# Altium schematic sheet MCU2.SchDoc: Hat MCU Group 24
size A3; DrawnBy: Jonny, Jamie, John, David; Address1: ECE Department; Address2: University of Canterbury; Address3: Christchurch 8041; Address4: New Zealand; Revision: 2; SheetNumber: 2; SheetTotal: 2; ImagePath: \\maxwell\elecapp\AltiumDesigner\Templates\uc-logo.png
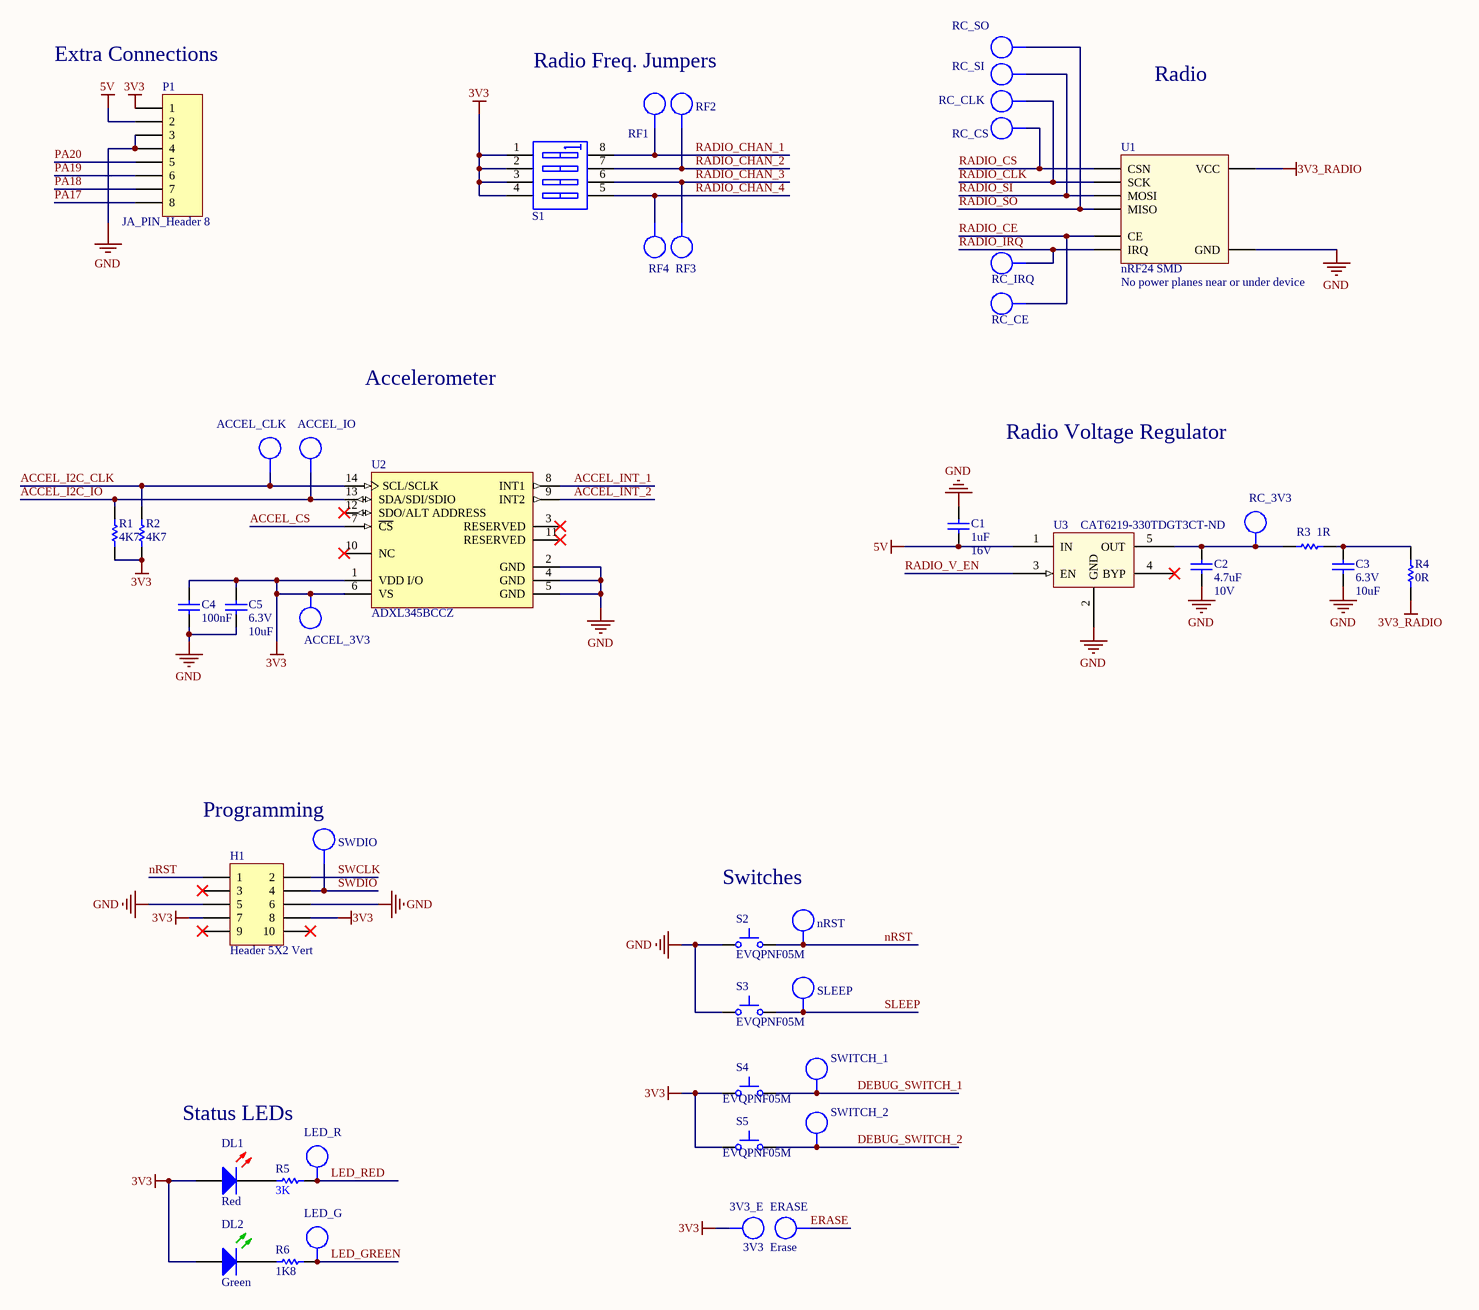
[diagram p0: MCU2.SchDoc]

## Parts
3V3_E  3V3  [TP_1206]  (no BOM)
ACCEL_3V3  TP  [TP_1206]  (value not drawn)  (no BOM)
ACCEL_CLK  TP  [TP_1206]  (value not drawn)  (no BOM)
ACCEL_IO  TP  [TP_1206]  (value not drawn)  (no BOM)
C1  Max Voltage: 16V  [CAPC1608L]  (hidden comment: 1uF)
C2  Max Voltage: 10V  [CAPC1608N]  (hidden comment: 4.7uF)
C3  Voltage - Rated: 6.3V  [CAPC1608L]  (hidden comment: 10uF)
C4  100nF  [CAPC1608L]
C5  Voltage - Rated: 6.3V  [CAPC1608L]  (hidden comment: 10uF)
DL1  Red  [WL-SMCW0603]
DL2  Green  [WL-SMCW0603]
ERASE  Erase  [TP_1206]  (no BOM)
H1  Header 5X2 Vert  [IDC2.54-V10D]
LED_G  TP  [TP_1206]  (value not drawn)  (no BOM)
LED_R  TP  [TP_1206]  (value not drawn)  (no BOM)
nRST  TP  [TP_1206]  (value not drawn)  (no BOM)
P1  JA_PIN_Header 8  [HDR1X8]
R1  4K7  [RESC1608L]
R2  4K7  [RESC1608L]
R3  1R  [RESC3216L]
R4  0R  [RESC1608L]
R5  3K  [RESC1608L]
R6  1K8  [RESC1608L]
RC_3V3  TP  [TP_1206]  (value not drawn)  (no BOM)
RC_CE  TP  [TP_1206]  (value not drawn)  (no BOM)
RC_CLK  TP  [TP_1206]  (value not drawn)  (no BOM)
RC_CS  TP  [TP_1206]  (value not drawn)  (no BOM)
RC_IRQ  TP  [TP_1206]  (value not drawn)  (no BOM)
RC_SI  TP  [TP_1206]  (value not drawn)  (no BOM)
RC_SO  TP  [TP_1206]  (value not drawn)  (no BOM)
RF1  TP  [TP_1206]  (value not drawn)  (no BOM)
RF2  TP  [TP_1206]  (value not drawn)  (no BOM)
RF3  TP  [TP_1206]  (value not drawn)  (no BOM)
RF4  TP  [TP_1206]  (value not drawn)  (no BOM)
S1  WS_SW DIP-4  [DIP_SW_4WAY_SMD -]  (value not drawn)
S2  EVQPNF05M  [EVQPNF05M]
S3  EVQPNF05M  [EVQPNF05M]
S4  EVQPNF05M  [EVQPNF05M]
S5  EVQPNF05M  [EVQPNF05M]
SLEEP  TP  [TP_1206]  (value not drawn)  (no BOM)
SWDIO  TP  [TP_1206]  (value not drawn)  (no BOM)
SWITCH_1  TP  [TP_1206]  (value not drawn)  (no BOM)
SWITCH_2  TP  [TP_1206]  (value not drawn)  (no BOM)
U1  nRF24 SMD  Warning: No power planes near or under device  [NRF24]
U2  ADXL345BCCZ  [ADI-CC-14-1_V]
U3  Supplier Part Number: CAT6219-330TDGT3CT-ND  [SOT95P280X145-5N]  (hidden comment: CAT6219-330TDGT3)

## Nets
3V3: 3V3_E.1 ACCEL_3V3.1 C4.2 C5.2 DL1.2(A) DL2.2(A) H1.7 H1.8 P1.1 R1.1 R2.1 S1.1(A1) S1.2(A2) S1.3(A3) S1.4(A4) S4.1 S5.1 U2.1(VDD_I/O) U2.6(VS)
3V3_RADIO: R4.1 U1.1(VCC)
5V: C1.1 P1.2 U3.1(IN)
GND: C1.2 C2.1 C3.1 C4.1 C5.1 H1.5 H1.6 P1.3 P1.4 S2.1 S3.1 U1.2(GND) U2.2(GND) U2.4(GND) U2.5(GND) U3.2(GND)
ACCEL_CS: U2.7(~{CS})
ACCEL_I2C_CLK: ACCEL_CLK.1 R2.2 U2.14(SCL/SCLK)
ACCEL_I2C_IO: ACCEL_IO.1 R1.2 U2.13(SDA/SDI/SDIO)
ACCEL_INT_1: U2.8(INT1)
ACCEL_INT_2: U2.9(INT2)
DEBUG_SWITCH_1: S4.2 SWITCH_1.1
DEBUG_SWITCH_2: S5.2 SWITCH_2.1
ERASE: ERASE.1
LED_GREEN: LED_G.1 R6.2
LED_RED: LED_R.1 R5.2
nRST: H1.1 nRST.1 S2.2
PA17: P1.8
PA18: P1.7
PA19: P1.6
PA20: P1.5
RADIO_CE: RC_CE.1 U1.3(CE)
RADIO_CHAN_1: RF1.1 S1.8(B1)
RADIO_CHAN_2: RF2.1 S1.7(B2)
RADIO_CHAN_3: RF3.1 S1.6(B3)
RADIO_CHAN_4: RF4.1 S1.5(B4)
RADIO_CLK: RC_CLK.1 U1.5(SCK)
RADIO_CS: RC_CS.1 U1.4(CSN)
RADIO_IRQ: RC_IRQ.1 U1.8(IRQ)
RADIO_SI: RC_SI.1 U1.6(MOSI)
RADIO_SO: RC_SO.1 U1.7(MISO)
RADIO_V_EN: U3.3(EN)
SLEEP: S3.2 SLEEP.1
SWCLK: H1.2
SWDIO: H1.4 SWDIO.1
NetC2_2: C2.2 R3.1 RC_3V3.1 U3.5(OUT)
NetC3_2: C3.2 R3.2 R4.2
NetDL1_1: DL1.1(K) R5.1
NetDL2_1: DL2.1(K) R6.1

Not connected (* = marked no-connect by the designer): H1 3* 9* 10*; U2 3(RESERVED)* 10(NC)* 11(RESERVED)* 12(SDO/ALT_ADDRESS)*; U3 4(BYP)*

## Notes on the sheet
- (near P1) Extra Connections
- Radio Freq. Jumpers
- Radio
- Accelerometer
- Radio Voltage Regulator
- (near SWDIO) Programming
- Switches
- Status LEDs
- Title
- Drawn by:
- Date:
- Time:
- Revision:
- Sheet
- of
- File:

## Library data of the parts
3V3_E ERASE = TP_1206: Test-Point 3.3x1.6x2.1mm SMD; Manufacturer: Harwin Inc; Manufacturer Part Number: S1751-46R; Value: TP; Manufacturer PN: *; Storage Location: ProtoPlace; Mounting Type: Surface Mount; Type: PC Test Point; Supplier 1: Digi-Key; Supplier Part Number 1: 952-1478-2-ND; Supplier 2: Farnell; Supplier Part Number 2: 1826282; Supplier: ECE Dept
ACCEL_3V3 ACCEL_CLK ACCEL_IO LED_G LED_R nRST RC_3V3 RC_CE RC_CLK RC_CS RC_IRQ RC_SI RC_SO RF1-RF4 SLEEP SWDIO SWITCH_1 SWITCH_2 = TP_1206: Test-Point 3.3x1.6x2.1mm SMD; Manufacturer: Harwin Inc; Manufacturer Part Number: S1751-46R; Supplier 1: Digi-Key; Mounting Type: Surface Mount; Type: PC Test Point; Supplier Part Number 1: 952-1478-2-ND; Manufacturer PN: *; Storage Location: ProtoPlace; Supplier 2: Farnell; Supplier Part Number 2: 1826282; Supplier: ECE Dept; Value: TP
C1 = CC_1uF_0603: CAP CER 1uF Y5V -20% +80% 16V 0603; PackageReference: 0603; Code_IPC: 1608 [0603]; Verify: *; Supplier: ECE Dept; Storage Location: PCB Assembly WS; Value: 1uF
C2 = CC_4.7uF_0603: CAP CER 4.7uF X5R +-20%  10V 0603; Note: Footprint corresponds to dimensions for bulk cassette packaging. This case size has tightened tolerances.; PackageReference: 0805; Code_IPC: 2012[0805]; Verify: *; Supplier: ECE Dept; Storage Location: PCB Assembly WS; Value: 4.7uF
C3 C5 = CC_10uF_0603: CAP CER 10UF X5R +-20% 6V3 0603; Supplier: ECE Dept; Storage Location: PCB Assembly WS; Value: 10uF
C4 = CC_100nF_0603: CAP CER 100nF X7R +-10% 50V 0603; PackageReference: 0603; Code_IPC: 1608 [0603]; Verify: *; Supplier: ECE Dept; Storage Location: PCB Assembly WS; Value: 100nF
DL1 = DL_150060RS75000: LED Red 250mcd 0603 SMD; Manufacturer: WURTH ELEKTRONIK; Forward Current If: 30; Forward Voltage: 2; Lens Shape: Rectangular; Luminous Intensity: 250; Wavelength Typ: 625; Viewing Angle: 140°; LED Mounting: SMD; Supplier 1: Farnell; Supplier Part Number 1: 2322071; Manufacturer Part Number: 150060RS75000; Storage Location: PCB Assembly WS; Supplier: ECE Dept; LED Colour: Red
DL2 = DL_150060GS75000: LED Green 430mcd 0603 SMD; Manufacturer: WURTH ELEKTRONIK; Forward Current If: 30; Wavelength Typ: 520; Forward Voltage: 3.2; Lens Shape: Rectangular; Luminous Intensity: 430; Viewing Angle: 140°; LED Mounting: SMD; Supplier 1: Farnell; Supplier Part Number 1: 2322070; Manufacturer Part Number: 150060GS75000; Storage Location: PCB Assembly WS; Supplier: ECE Dept; LED Colour: Green
H1 = JA_HDR_IDC_5X2_VERT: IDC Header, 2,54mm, 10-Pin, Vert; Supplier: ECE Dept; Supplier 1: Farnell; Supplier Part Number 1: 1096985; Storage Location: ECE Dept Store
P1 = JA_PIN_Header 8: Header, 8-Pin; LatestRevisionDate: 17-Jul-2002; LatestRevisionNote: Re-released for DXP Platform.; Publisher: Altium Limited
R1 R2 = RS_4K7: RES 4.7K OHM 1/10W 5% 0603 SMD; Storage Location: PCB Assembly WS; Supplier: ECE Dept; Value: 4K7
R3 = RT_1R: RES 1R OHM 1/4W 5% 1206 SMD; Storage Location: PCB Assembly WS; Supplier: ECE Dept; Value: 1R
R4 = RS_0R0: RES 0.0 OHM 1/10W 5% 0603 SMD; Storage Location: PCB Assembly WS; Supplier: ECE Dept; Value: 0R
R5 = RS_3K: RES 3K OHM 1/10W 5% 0603 SMD; Storage Location: PCB Assembly WS; Supplier: ECE Dept; Value: 3K
R6 = RS_1K8: RES 1.8K OHM 1/10W 5% 0603 SMD; Storage Location: PCB Assembly WS; Supplier: ECE Dept; Value: 1K8
S1 = WS_SW DIP-4: DIP Switch, 4 Position, SPST SMD; Manufacturer: OMRON ELECTRONIC COMPONENTS; Manufacturer Part Number: A6SN-4101; Contact Current DC Max: 25; External Length / Height: 12.1; No. of Switch Positions: 4; Pitch Spacing: 2.54; Contact Configuration: SPST; Supplier 1: Farnell; Supplier Part Number 1: 2029425; Storage Location: PCB Assembly WS; Supplier: ECE Dept
S2-S5 = WS_EVQPNF05M: Panasonic 6 x 3.5mm SMD Light Touch Switch Type SMD; PackageDescription: 6.0 x 3.5 mm; Supplier 1: Farnell; Supplier Part Number 1: 2079481; Manufacturer: Panasonic; Manufacturer PN: EVQPNF05M; Supplier 2: Digi-Key; Supplier Part Number 2: P13598SCT-ND; Storage Location: PCB Assembly WS; Supplier: ECE Dept
U1 = NRF24: nRF24 SMD Module
U2 = ADXL345BCCZ: Accelerometer 3-Axis, +/-2 g / +/-4 g / +/-8 g / +/-16 g with Digital Output, 1.6 KHz BW, Industrial, 14-pin LGA, Tray; Manufacturer: Analog Devices; Sensitivity: 256/128/64/32 LSB/g; Voltage Supply (V): 2.0 to 3.6; Supply Current: 140 uA; # of Axes: 3; -3dB Bandwidth: 1.6 KHz; PackageReference: CC-14-1; ComponentLink1Description: Manufacturer URL; Packing: Tray; ComponentLink4URL: http://www.analog.com/en/mems-sensors/mems-inertial-sensors/adxl345/products/product.html; ComponentLink2URL: http://www.analog.com/static/imported-files/data_sheets/ADXL345.pdf; Mounting Technology: Surface Mount; ComponentLink3URL: http://www.analog.com/static/imported-files/data_sheets/ADXL343.pdf; PartNumber: ADXL345BCCZ; ComponentLink4Description: Product URL; Output Type: Digital; ComponentLink3Description: Package Specification; DatasheetVersion: Rev. D; PackageVersion: 03-16-2010-A, 03/2010; ComponentLink1URL: http://www.analog.com/en/index.html; ComponentLink2Description: Datasheet; PackageDescription: 14-Pin Land Grid Array, 3 x 5 mm Body, 0.8 mm Pitch; Manufacturer 1: Analog Devices; Manufacturer Part Number 1: ADXL345BCCZ
U3 = SV_CAT6219-330TDGT3: IC REG LIN 3.3V 500MA TSOT23-5; Voltage - Input (Max): 5.5V; Voltage Dropout (Max): 0.5V @ 500mA; Manufacturer Part Number: CAT6219-330TDGT3; Base Part Number: CAT6219; Current - Output: 500mA; Package / Case: SOT-23-5 Thin, TSOT-23-5; Supplier: Digi-Key; Supplier Device Package: TSOT-23-5; Voltage - Output (Min/Fixed): 3.3V; ComponentLink1URL: http://www.onsemi.com/pub/Collateral/CAT6219-D.PDF; ComponentLink1Description: http://www.onsemi.com/pub/Collateral/CAT6219-D.PDF; Supplier 1: Digi-Key; ComponentLink2Description: CAT6219 Datasheet; ComponentLink2URL: \\maxwell\elecapp\AltiumDesigner\Libraries\DatasheetsNew\ENCE461\CAT6219-D.PDF